# Altium schematic sheet 电梯主控板V2.1.SchDoc
size A3
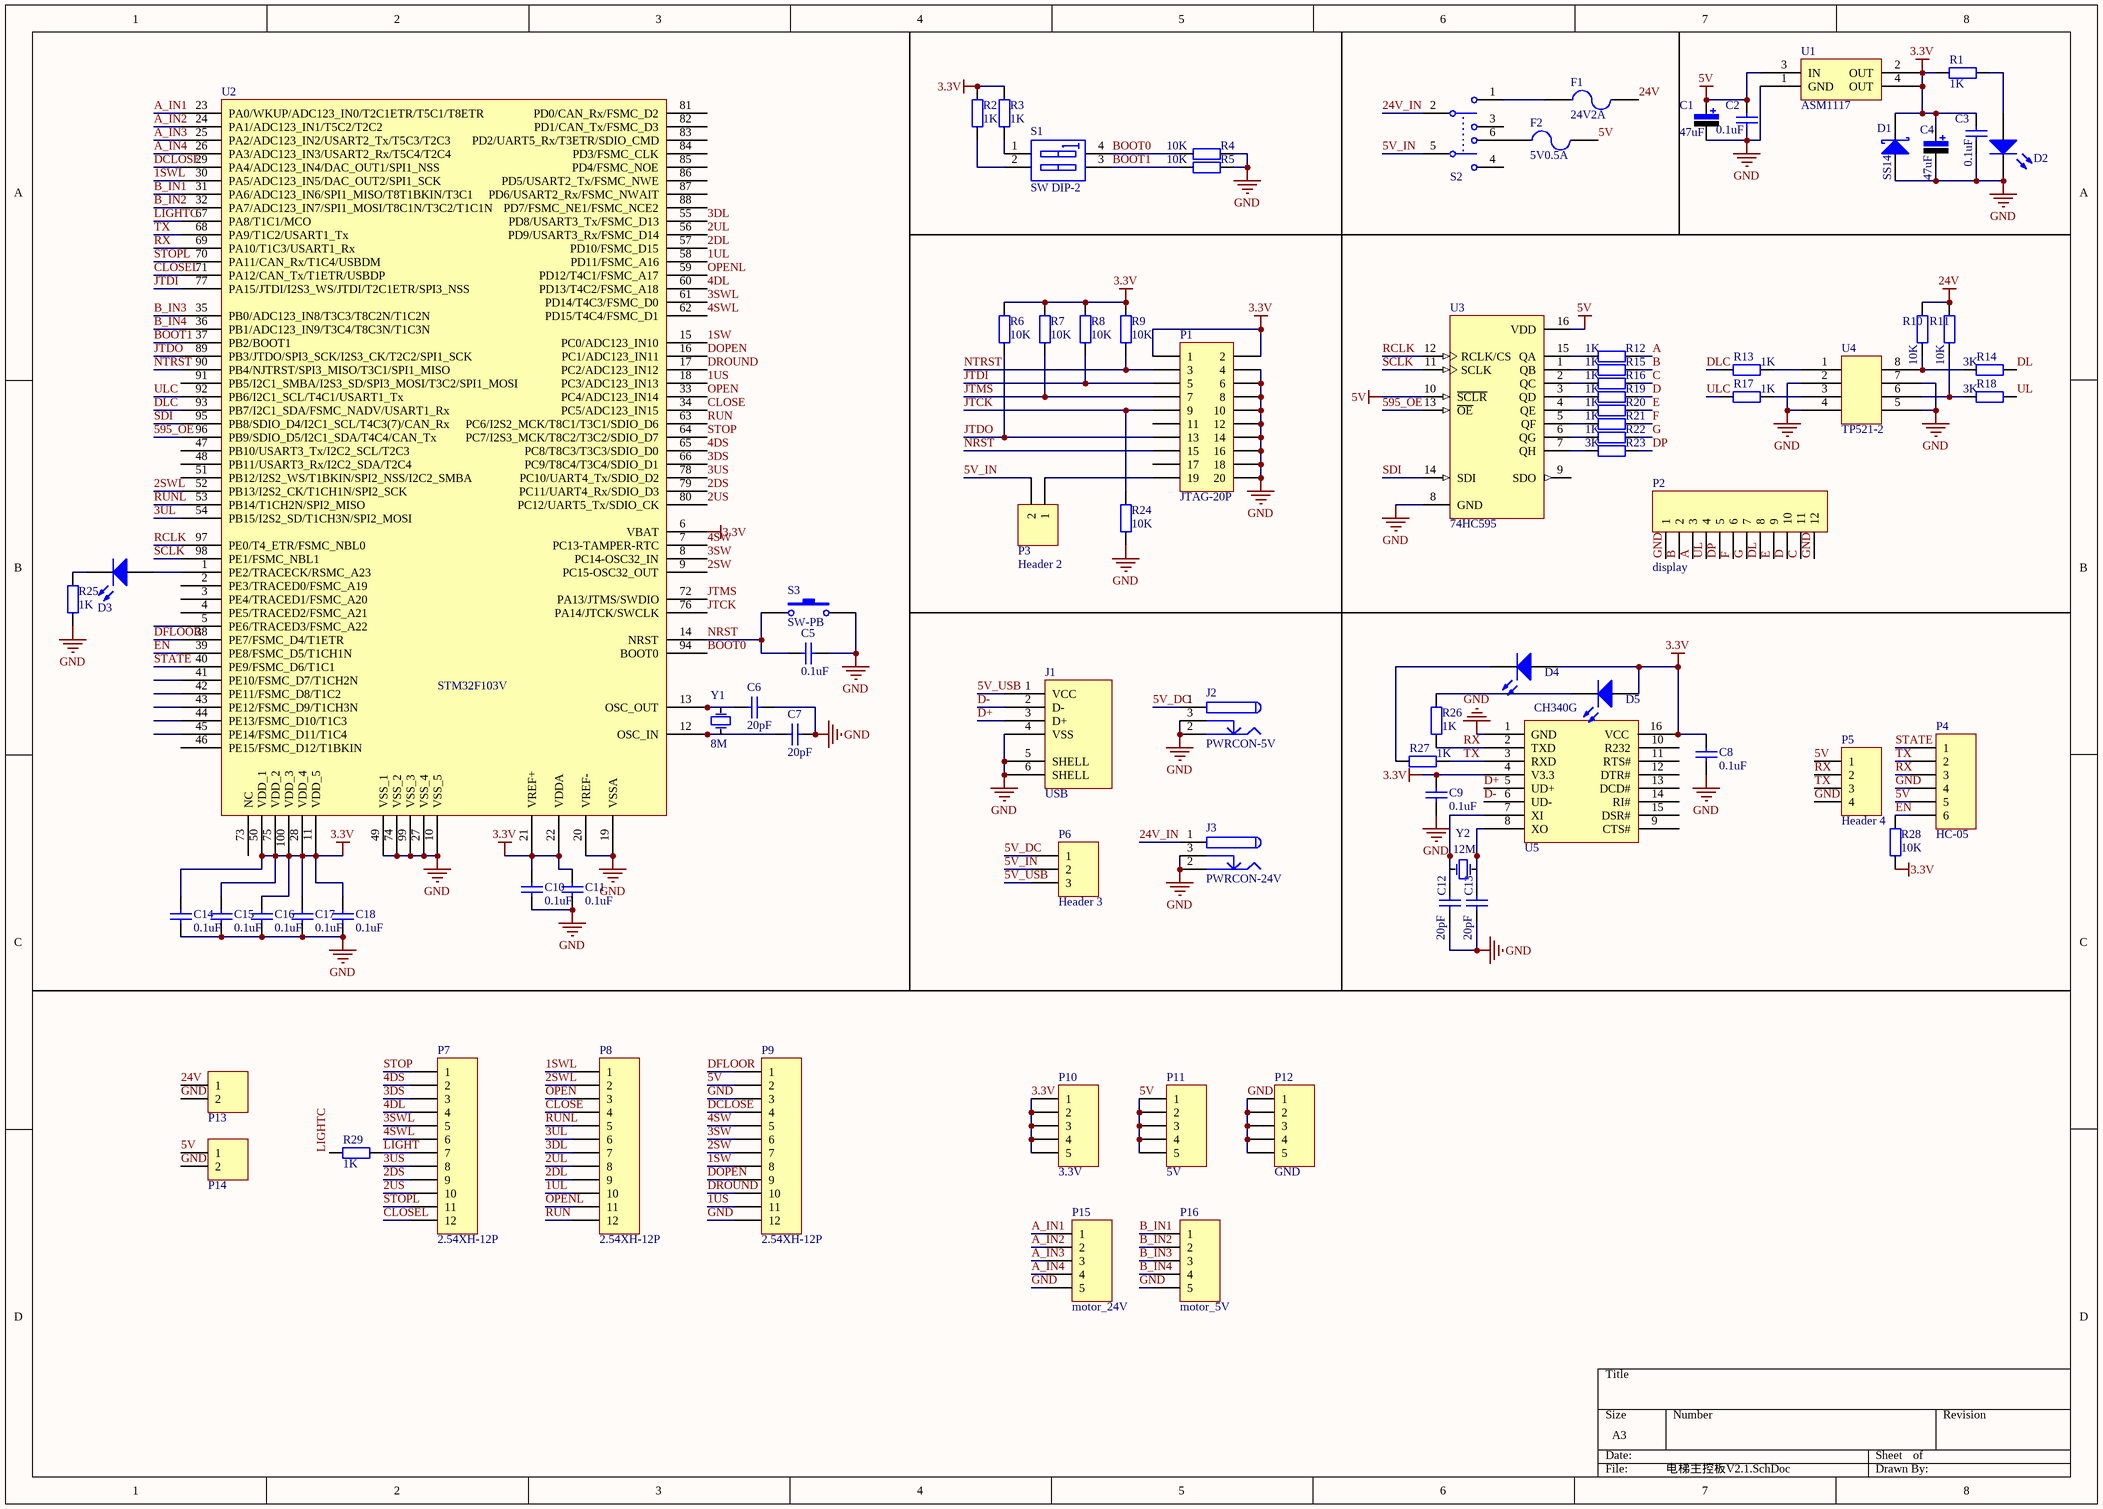
[diagram p0: 电梯主控板V2.1.SchDoc]

## Parts
C1  47uF  [CAP-3528]
C2  0.1uF  [C-0805]
C3  0.1uF  [C-0805]
C4  47uF  [CAP-3528]
C5  0.1uF  [C-0805]
C6  20pF  [C-0805]
C7  20pF  [C-0805]
C8  0.1uF  [C-0805]
C9  0.1uF  [C-0805]
C10  0.1uF  [C-0805]
C11  0.1uF  [C-0805]
C12  20pF  [C-0805]
C13  20pF  [C-0805]
C14  0.1uF  [C-0805]
C15  0.1uF  [C-0805]
C16  0.1uF  [C-0805]
C17  0.1uF  [C-0805]
C18  0.1uF  [C-0805]
D1  Type: SS14  [D-SMA]  (hidden comment: Diode-Schottky)
D2  LED0  [LED-0805]  (value not drawn)
D3  LED0  [LED-0805]  (value not drawn)
D4  LED0  [LED-0805]  (value not drawn)
D5  LED0  [LED-0805]  (value not drawn)
F1  24V2A  [1812]
F2  5V0.5A  [1812]
J1  USB  [USB_A1]
J2  PWRCON-5V  [DC-002]
J3  PWRCON-24V  [DC-005]
P1  JTAG-20P  [DC3-20P]
P2  display  [2.54XH-12P]
P3  Header 2  [HDR1X2]
P4  HC-05  [HDR1X6]
P5  Header 4  [HDR1X4]
P6  Header 3  [HDR1X3]
P7  2.54XH-12P  [2.54XH-12P]
P8  2.54XH-12P  [2.54XH-12P]
P9  2.54XH-12P  [2.54XH-12P]
P10  3.3V  [HDR1X5]
P11  5V  [HDR1X5]
P12  GND  [HDR1X5]
P13  KF301-2P  [KF301-2P]  (value not drawn)
P14  KF301-2P  [KF301-2P]  (value not drawn)
P15  motor_24V  [2.54xh-5P]
P16  motor_5V  [2.54xh-5P]
R1  1K  [0805-1]
R2  1K  [0805-1]
R3  1K  [0805-1]
R4  10K  [0805-1]
R5  10K  [0805-1]
R6  10K  [0805-1]
R7  10K  [0805-1]
R8  10K  [0805-1]
R9  10K  [0805-1]
R10  10K  [0805-1]
R11  10K  [0805-1]
R12  1K  [0805-1]
R13  1K  [0805-1]
R14  3K  [0805-1]
R15  1K  [0805-1]
R16  1K  [0805-1]
R17  1K  [0805-1]
R18  3K  [0805-1]
R19  1K  [0805-1]
R20  1K  [0805-1]
R21  1K  [0805-1]
R22  1K  [0805-1]
R23  3K  [0805-1]
R24  10K  [0805-1]
R25  1K  [0805-1]
R26  1K  [0805-1]
R27  1K  [0805-1]
R28  10K  [0805-1]
R29  1K  [0805-1]
S1  SW DIP-2  [DIP-4]
S2  六脚钮子开关  [六脚纽子开关]  (value not drawn)
S3  SW-PB  [SW_PB2_A1]
U1  ASM1117  [SOT223]
U2  STM32F103V  [LQFP-100]
U3  74HC595  [SOIC-16]
U4  TP521-2  [DIP8]
U5  CH340G  [SOP16]  (value not drawn)
Y1  8M  [X-HC-49S]
Y2  12M  [X-HC-49S]

## Nets
3.3V: C3.2 C4.1 C8.2 C9.2 C10.2 C11.2 C14.2 C15.2 C16.2 C17.2 C18.2 D1.2(K) D4.1(A) D5.1(A) P1.1 P1.2 P10.1 P10.2 P10.3 P10.4 P10.5 R1.1 R2.2 R3.2 R6.2 R7.2 R8.2 R9.2 R28.1 U1.2(OUT) U1.4(OUT) U2.6(VBAT) U2.11(VDD_5) U2.21(VREF+) U2.22(VDDA) U2.28(VDD_4) U2.50(VDD_1) U2.75(VDD_2) U2.100(VDD_3) U5.4(V3.3) U5.16(VCC)
5V: C1.1 C2.2 F2.2 P4.5 P5.1 P9.2 P11.1 P11.2 P11.3 P11.4 P11.5 P14.1 U1.3(IN) U3.10(~{SCLR}) U3.16(VDD)
24V: F1.2 P13.1 R10.2 R11.2
GND: C1.2 C2.1 C3.1 C4.2 C5.2 C6.2 C7.2 C8.1 C9.1 C10.1 C11.1 C12.1 C13.1 C14.1 C15.1 C16.1 C17.1 C18.1 D1.1(A) D2.2(K) J1.4(VSS) J1.5(SHELL) J1.6(SHELL) J2.2 J2.3 J3.2 J3.3 P1.4 P1.6 P1.8 P1.10 P1.12 P1.14 P1.16 P1.18 P1.20 P2.1 P2.12 P4.4 P5.4 P9.3 P9.12 P12.1 P12.2 P12.3 P12.4 P12.5 P13.2 P14.2 P15.5 P16.5 R4.2 R5.2 R24.1 R25.1 S3.2 U1.1(GND) U2.10(VSS_5) U2.19(VSSA) U2.20(VREF-) U2.27(VSS_4) U2.49(VSS_1) U2.74(VSS_2) U2.99(VSS_3) U3.8(GND) U4.2 U4.4 U4.5 U4.7 U5.1(GND)
1SW: P9.8 U2.15(PC0/ADC123_IN10)
1SWL: P8.1 U2.30(PA5/ADC123_IN5/DAC_OUT2/SPI1_SCK)
1UL: P8.10 U2.58(PD11/FSMC_A16)
1US: P9.11 U2.18(PC3/ADC123_IN13)
2DL: P8.9 U2.57(PD10/FSMC_D15)
2DS: P7.9 U2.79(PC11/UART4_Rx/SDIO_D3)
2SW: P9.7 U2.9(PC15-OSC32_OUT)
2SWL: P8.2 U2.52(PB13/I2S2_CK/T1CH1N/SPI2_SCK)
2UL: P8.8 U2.56(PD9/USART3_Rx/FSMC_D14)
2US: P7.10 U2.80(PC12/UART5_Tx/SDIO_CK)
3DL: P8.7 U2.55(PD8/USART3_Tx/FSMC_D13)
3DS: P7.3 U2.66(PC9/T8C4/T3C4/SDIO_D1)
3SW: P9.6 U2.8(PC14-OSC32_IN)
3SWL: P7.5 U2.61(PD14/T4C3/FSMC_D0)
3UL: P8.6 U2.54(PB15/I2S2_SD/T1CH3N/SPI2_MOSI)
3US: P7.8 U2.78(PC10/UART4_Tx/SDIO_D2)
4DL: P7.4 U2.60(PD13/T4C2/FSMC_A18)
4DS: P7.2 U2.65(PC8/T8C3/T3C3/SDIO_D0)
4SW: P9.5 U2.7(PC13-TAMPER-RTC)
4SWL: P7.6 U2.62(PD15/T4C4/FSMC_D1)
5V_DC: J2.1 P6.1
5V_IN: P3.2 P6.2 S2.5
5V_USB: J1.1(VCC) P6.3
24V_IN: J3.1 S2.2
595_OE: U2.96(PB9/SDIO_D5/I2C1_SDA/T4C4/CAN_Tx) U3.13(~{OE})
A: P2.3 R12.2
A_IN1: P15.1 U2.23(PA0/WKUP/ADC123_IN0/T2C1ETR/T5C1/T8ETR)
A_IN2: P15.2 U2.24(PA1/ADC123_IN1/T5C2/T2C2)
A_IN3: P15.3 U2.25(PA2/ADC123_IN2/USART2_Tx/T5C3/T2C3)
A_IN4: P15.4 U2.26(PA3/ADC123_IN3/USART2_Rx/T5C4/T2C4)
B: P2.2 R15.2
B_IN1: P16.1 U2.31(PA6/ADC123_IN6/SPI1_MISO/T8T1BKIN/T3C1)
B_IN2: P16.2 U2.32(PA7/ADC123_IN7/SPI1_MOSI/T8C1N/T3C2/T1C1N)
B_IN3: P16.3 U2.35(PB0/ADC123_IN8/T3C3/T8C2N/T1C2N)
B_IN4: P16.4 U2.36(PB1/ADC123_IN9/T3C4/T8C3N/T1C3N)
BOOT0: R4.1 S1.4(B1) U2.94(BOOT0)
BOOT1: R5.1 S1.3(B2) U2.37(PB2/BOOT1)
C: P2.11 R16.2
CLOSE: P8.4 U2.34(PC5/ADC123_IN15)
CLOSEL: P7.12 U2.71(PA12/CAN_Tx/T1ETR/USBDP)
D: P2.10 R19.2
D+: J1.3(D+) U5.5(UD+)
D-: J1.2(D-) U5.6(UD-)
DCLOSE: P9.4 U2.29(PA4/ADC123_IN4/DAC_OUT1/SPI1_NSS)
DFLOOR: P9.1 U2.38(PE7/FSMC_D4/T1ETR)
DL: P2.8 R14.2
DLC: R13.1 U2.93(PB7/I2C1_SDA/FSMC_NADV/USART1_Rx)
DOPEN: P9.9 U2.16(PC1/ADC123_IN11)
DP: P2.5 R23.2
DROUND: P9.10 U2.17(PC2/ADC123_IN12)
E: P2.9 R20.2
EN: P4.6 R28.2 U2.39(PE8/FSMC_D5/T1CH1N)
F: P2.6 R21.2
G: P2.7 R22.2
JTCK: P1.9 R24.2 U2.76(PA14/JTCK/SWCLK)
JTDI: P1.5 R8.1 U2.77(PA15/JTDI/I2S3_WS/JTDI/T2C1ETR/SPI3_NSS)
JTDO: P1.13 R6.1 U2.89(PB3/JTDO/SPI3_SCK/I2S3_CK/T2C2/SPI1_SCK)
JTMS: P1.7 R7.1 U2.72(PA13/JTMS/SWDIO)
LIGHT: P7.7 R29.2
LIGHTC: R29.1 U2.67(PA8/T1C1/MCO)
NRST: C5.1 P1.15 S3.1 U2.14(NRST)
NTRST: P1.3 R9.1 U2.90(PB4/NJTRST/SPI3_MISO/T3C1/SPI1_MISO)
OPEN: P8.3 U2.33(PC4/ADC123_IN14)
OPENL: P8.11 U2.59(PD12/T4C1/FSMC_A17)
RCLK: U2.97(PE0/T4_ETR/FSMC_NBL0) U3.12(RCLK/CS)
RUN: P8.12 U2.63(PC6/I2S2_MCK/T8C1/T3C1/SDIO_D6)
RUNL: P8.5 U2.53(PB14/T1CH2N/SPI2_MISO)
RX: P4.3 P5.2 R26.1 U2.69(PA10/T1C3/USART1_Rx) U5.2(TXD)
SCLK: U2.98(PE1/FSMC_NBL1) U3.11(SCLK)
SDI: U2.95(PB8/SDIO_D4/I2C1_SCL/T4C3(7)/CAN_Rx) U3.14(SDI)
STATE: P4.1 U2.40(PE9/FSMC_D6/T1C1)
STOP: P7.1 U2.64(PC7/I2S3_MCK/T8C2/T3C2/SDIO_D7)
STOPL: P7.11 U2.70(PA11/CAN_Rx/T1C4/USBDM)
TX: P4.2 P5.3 R27.2 U2.68(PA9/T1C2/USART1_Tx) U5.3(RXD)
UL: P2.4 R18.2
ULC: R17.1 U2.92(PB6/I2C1_SCL/T4C1/USART1_Tx)
NetC6_1: C6.1 U2.13(OSC_OUT) Y1.1(OSC1)
NetC7_1: C7.1 U2.12(OSC_IN) Y1.2(OSC2)
NetC12_2: C12.2 U5.7(XI) Y2.2(OSC2)
NetC13_2: C13.2 U5.8(XO) Y2.1(OSC1)
NetD2_1: D2.1(A) R1.2
NetD3_1: D3.1(A) U2.1(PE2/TRACECK/RSMC_A23)
NetD3_2: D3.2(K) R25.2
NetD4_2: D4.2(K) R27.1
NetD5_2: D5.2(K) R26.2
NetF1_1: F1.1 S2.1
NetF2_1: F2.1 S2.6
NetP1_19: P1.19 P3.1
NetR2_1: R2.1 S1.2(A2)
NetR3_1: R3.1 S1.1(A1)
NetR10_1: R10.1 R14.1 U4.8
NetR11_1: R11.1 R18.1 U4.6
NetR12_1: R12.1 U3.15(QA)
NetR13_2: R13.2 U4.1
NetR15_1: R15.1 U3.1(QB)
NetR16_1: R16.1 U3.2(QC)
NetR17_2: R17.2 U4.3
NetR19_1: R19.1 U3.3(QD)
NetR20_1: R20.1 U3.4(QE)
NetR21_1: R21.1 U3.5(QF)
NetR22_1: R22.1 U3.6(QG)
NetR23_1: R23.1 U3.7(QH)

Not connected (* = marked no-connect by the designer): P1 11 17; S2 3 4; U2 2(PE3/TRACED0/FSMC_A19) 3(PE4/TRACED1/FSMC_A20) 4(PE5/TRACED2/FSMC_A21) 5(PE6/TRACED3/FSMC_A22) 41(PE10/FSMC_D7/T1CH2N) 42(PE11/FSMC_D8/T1C2) 43(PE12/FSMC_D9/T1CH3N) 44(PE13/FSMC_D10/T1C3) 45(PE14/FSMC_D11/T1C4) 46(PE15/FSMC_D12/T1BKIN) 47(PB10/USART3_Tx/I2C2_SCL/T2C3) 48(PB11/USART3_Rx/I2C2_SDA/T2C4) 51(PB12/I2S2_WS/T1BKIN/SPI2_NSS/I2C2_SMBA) 73(NC) 81(PD0/CAN_Rx/FSMC_D2) 82(PD1/CAN_Tx/FSMC_D3) 83(PD2/UART5_Rx/T3ETR/SDIO_CMD) 84(PD3/FSMC_CLK) 85(PD4/FSMC_NOE) 86(PD5/USART2_Tx/FSMC_NWE) 87(PD6/USART2_Rx/FSMC_NWAIT) 88(PD7/FSMC_NE1/FSMC_NCE2) 91(PB5/I2C1_SMBA/I2S3_SD/SPI3_MOSI/T3C2/SPI1_MOSI); U3 9(SDO); U5 9(CTS#) 10(R232) 11(RTS#) 12(DTR#) 13(DCD#) 14(RI#) 15(DSR#)

## Library data of the parts
C1 C4 = Cap-Pol-A: 钽电容; Published: 8-Jun-2000; LatestRevisionDate: 17-Jul-2002; LatestRevisionNote: Re-released for DXP Platform.; PackageReference: RB7.6-15; Publisher: Altium Limited; Value: 47uF; combak: Cap-Pol
C2 C3 C5-C18 = Cap-S: 贴片瓷片电容; Published: 8-Jun-2000; LatestRevisionDate: 17-Jul-2002; LatestRevisionNote: Re-released for DXP Platform.; PackageReference: RAD-0.3; Publisher: Altium Limited; combak: Cap-S
  C2 C3 C5 C8-C11 C14-C18: Value: 0.1uF
  C6 C7 C12 C13: Value: 20pF
D1 = Diode-Schottky: 肖特基二极管; Published: 8-Jun-2000; LatestRevisionDate: 17-Jul-2002; LatestRevisionNote: Re-released for DXP Platform.; PackageReference: SMB; Publisher: Altium Limited; Code_JEDEC: DO-214-AA; combak: Diode-Schottky
D2-D5 = LED0: 发光二极管; Published: 8-Jun-2000; LatestRevisionDate: 08-Jul-2005; LatestRevisionNote: Mech Layer 1 removed.; PackageReference: LED-0; Publisher: Altium Limited
  D2 D4 D5: combak: LED0
F1 F2 = Fuse2: 可恢复保险丝; Published: 8-Jun-2000; LatestRevisionDate: 17-Jul-2002; LatestRevisionNote: Re-released for DXP Platform.; PackageReference: PIN-W2/E2.8; Publisher: Altium Limited; combak: Fuse2
  F1: Value: 24V2A
  F2: Value: 5V0.5A
J1 = USB: USB接口; combak: USB
J2 J3 = PWRCON: 直流电源端子; Published: 17-Dec-2003; DatasheetDocument: 09-May-2002; Publisher: Altium Limited; ComponentLink1Description: Manufacturer Link; ComponentLink1URL: http://domino.kycon.com/internet/Products.html
  J2: combak: PWRCON-5V
  J3: combak: PWRCON-24V
P2 = 2.54XH-12P
P3 = Header 2: Header, 2-Pin; LatestRevisionDate: 17-Jul-2002; LatestRevisionNote: Re-released for DXP Platform.; Publisher: Altium Limited; combak: Header 2
P4 = Header 6: Header, 6-Pin; LatestRevisionDate: 17-Jul-2002; LatestRevisionNote: Re-released for DXP Platform.; Publisher: Altium Limited; combak: HC-05
P5 = Header 4: Header, 4-Pin; LatestRevisionDate: 17-Jul-2002; LatestRevisionNote: Re-released for DXP Platform.; Publisher: Altium Limited; combak: Header 4
P6 = Header 3: Header, 3-Pin; LatestRevisionDate: 17-Jul-2002; LatestRevisionNote: Re-released for DXP Platform.; Publisher: Altium Limited; combak: Header 3
P10-P12 = Header 5: Header, 5-Pin; LatestRevisionDate: 17-Jul-2002; LatestRevisionNote: Re-released for DXP Platform.; Publisher: Altium Limited
P15 P16 = 2.54XH-5P
R1-R29 = Res1: 贴片电阻; Published: 8-Jun-2000; LatestRevisionDate: 17-Jul-2002; LatestRevisionNote: Re-released for DXP Platform.; PackageReference: AXIAL-0.4; Publisher: Altium Limited
  R1 R12 R13 R15-R17 R19-R22 R26 R27: Value: 1K; combak: Res1
  R2 R3 R25 R29: Value: 1K
  R4 R5 R28: Value: 10K
  R6-R11 R24: Value: 10K; combak: Res1
  R14 R18 R23: Value: 3K; combak: Res1
S1 = SW DIP-2: DIP Switch, 2 Position, SPST; Published: 24-Mar-1999; LatestRevisionDate: 17-Jul-2002; LatestRevisionNote: Re-released for DXP Platform.; PackageReference: DIP-4; Publisher: Altium Limited; combak: SW DIP-2
S3 = SW-PB: 微动开关; Published: 24-Mar-1999; LatestRevisionDate: 17-Jul-2002; LatestRevisionNote: Re-released for DXP Platform.; PackageReference: SPST-2; Publisher: Altium Limited; combak: SW-PB
U1 = ASM1117: 3.3V稳压芯片; combak: ASM1117
U2 = STM32F103V: STM32单片机100引脚; combak: STM32F103V
U3 = 74HC595: 移位寄存器; ComponentAvailability: Not for New Design; Published: 15-Apr-2002; LatestRevisionDate: 13-Apr-2006; LatestRevisionNote: IPC-7351 Footprint Added.; DatasheetVersion: 1997; PackageVersion: 1997; PackageReference: 966-01; Publisher: Altium Limited; PackageDescription: 16-Pin Small Outline Package 1.27 mm Pitch; ComponentLink1Description: Manufacturer Link; ComponentLink1URL: http://www.onsemi.com/; ComponentLink2Description: Datasheet; ComponentLink2URL: http://www.onsemi.com/pub/Collateral/MC74VHC595-D.PDF; combak: 74HC595
U4 = P521-2: combak: TP521-2
Y1 Y2 = XTAL: 晶振; Published: 8-Jun-2000; LatestRevisionDate: 17-Jul-2002; LatestRevisionNote: Re-released for DXP Platform.; PackageReference: R38; Publisher: Altium Limited; combak: XTAL
  Y1: Value: 8M
  Y2: Value: 12M
P1 = JTAG-20P: combak: JTAG-20P
P7-P9 = 2.54XH-12P: Comment-bak: 2.54XH-12P
S2 = 六脚钮子开关: combak: 六脚钮子开关
U5 = CH340G: combak: CH340G